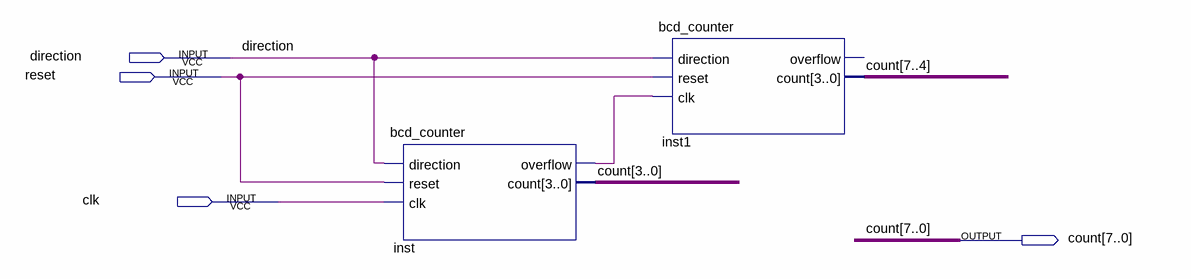
[diagram p0: schematic sheet]
// Quartus schematic two_digit_bcd.bdf as structural Verilog: 2 symbols, 4 pins
module two_digit_bcd (
  input  direction,
  input  reset,
  input  clk,
  output [7:0] count
);

  wire inst_overflow;

  bcd_counter inst (.direction(direction), .reset(reset), .clk(clk), .overflow(inst_overflow), .count(count[3:0]));
  bcd_counter inst1 (.direction(direction), .reset(reset), .clk(inst_overflow), .count(count[7:4]));  // open: overflow
endmodule
